# EAGLE design atmega_multimedia_control (EAGLE 6.4)
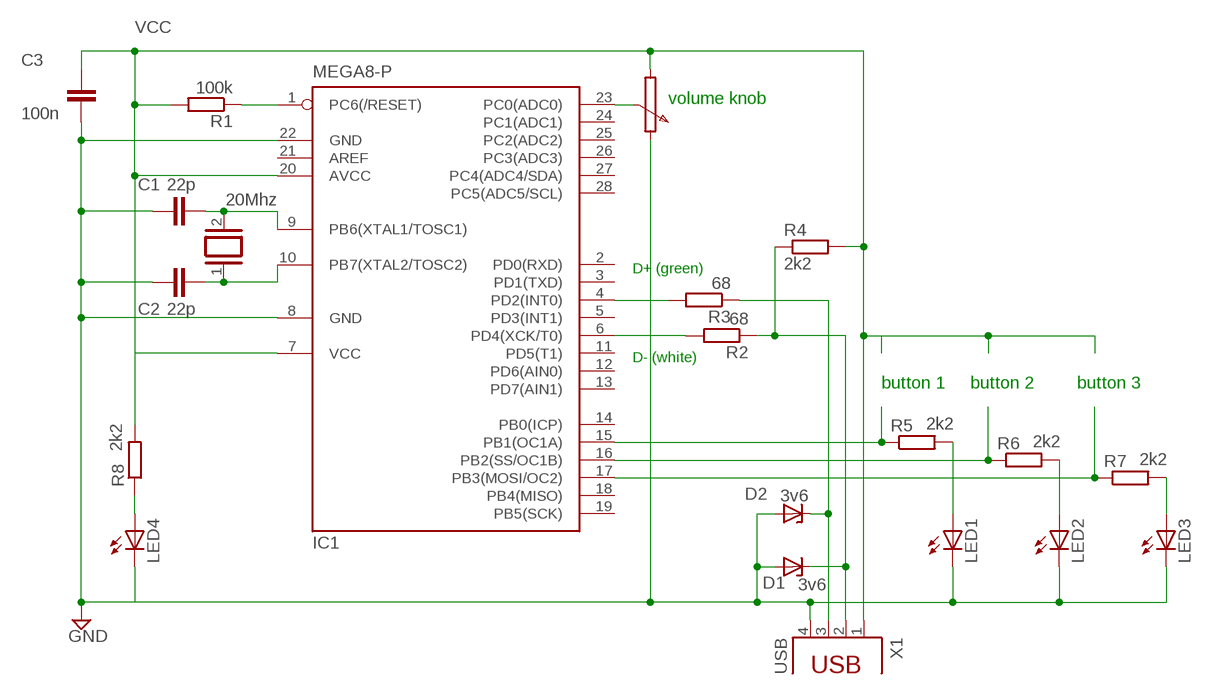
[diagram p0: schematic, sheet 1]

## Parts
C1  22p  C-EU025-025X050  [C025-025X050]
C2  22p  C-EU025-025X050  [C025-025X050]
C3  100n  C-EU025-025X050  [C025-025X050]
D1  3v6  ZENER-DIODEDO34-7  [DO34Z7]
D2  3v6  ZENER-DIODEDO34-7  [DO34Z7]
IC1  MEGA8-P  [DIL28-3]
LED1  LED3MM  [LED3MM]
LED2  LED3MM  [LED3MM]
LED3  LED3MM  [LED3MM]
LED4  LED3MM  [LED3MM]
Q1  20Mhz  XTAL/S  [QS]
R1  100k  R-EU_0204/7  [0204/7]
R2  68  R-EU_0204/7  [0204/7]
R3  68  R-EU_0204/7  [0204/7]
R4  2k2  R-EU_0204/7  [0204/7]
R5  2k2  R-EU_0204/7  [0204/7]
R6  2k2  R-EU_0204/7  [0204/7]
R7  2k2  R-EU_0204/7  [0204/7]
R8  2k2  R-EU_0204/7  [0204/7]
X1  USB  PN61729  [PN61729]

## Nets
GND: C1.1 C2.1 C3.1 D1.A D2.A IC1.8(GND) IC1.22(GND) LED1.K(C) LED2.K(C) LED3.K(C) LED4.K(C) X1.4
N$1: IC1.1(PC6(/RESET)) R1.1
N$2: C1.2 IC1.9(PB6(XTAL1/TOSC1)) Q1.2
N$3: C2.2 IC1.10(PB7(XTAL2/TOSC2)) Q1.1
N$4: D2.C R3.1 X1.3
N$5: IC1.6(PD4(XCK/T0)) R2.2
N$7: IC1.4(PD2(INT0)) R3.2
N$8: IC1.23(PC0(ADC0))
N$9: IC1.15(PB1(OC1A)) R5.1
N$10: LED1.A R5.2
N$11: IC1.16(PB2(SS/OC1B)) R6.1
N$12: LED2.A R6.2
N$13: IC1.17(PB3(MOSI/OC2)) R7.1
N$14: LED3.A R7.2
N$15: LED4.A R8.1
N$16: D1.C R2.1 R4.1 X1.2
VCC: C3.2 IC1.7(VCC) IC1.20(AVCC) R1.2 R4.2 R8.2 X1.1
Unconnected: IC1.2(PD0(RXD)) IC1.3(PD1(TXD)) IC1.5(PD3(INT1)) IC1.11(PD5(T1)) IC1.12(PD6(AIN0)) IC1.13(PD7(AIN1)) IC1.14(PB0(ICP)) IC1.18(PB4(MISO)) IC1.19(PB5(SCK)) IC1.21(AREF) IC1.24(PC1(ADC1)) IC1.25(PC2(ADC2)) IC1.26(PC3(ADC3)) IC1.27(PC4(ADC4/SDA)) IC1.28(PC5(ADC5/SCL))

## Notes on the sheet
- volume knob
- D+ (green)
- D- (white)
- button 1 | button 2 | button 3

## Library data of the parts
C1-C3 = rcl:C-EU: CAPACITOR, European symbol
D1 D2 = diode:ZENER-DIODE: Z-Diode
IC1 = atmel:MEGA8-P: MICROCONTROLLER 8 Kbytes FLASH, 1 kbytes SRAM, 512 bytes EEPROM, USART, 4-channel 10 bit ADC, 2-channel 8 bit ADC Pin compatible with Atmega48, ATMega88, ATMega168 Source: avr.lbr; OC_FARNELL: unknown; OC_NEWARK: unknown
LED1-LED4 = led:LED: LED OSRAM: - CHIPLED LG R971, LG N971, LY N971, LG Q971, LY Q971, LO R971, LY R971 LH N974, LH R974 LS Q976, LO Q976, LY Q976 LO Q996 - Hyper CHIPLED LW Q18S LB Q993, LB Q99A, LB R99A - SideLED LS A670, LO A670, LY A670, LG A670, LP A670 LB A673, LV A673, LT A673, LW A673 LH A674 LY A675 LS A676, LA A676, LO A676, LY A676, LW A676 LS A679, LY A679, LG A679 - Hyper Micro SIDELED® LS Y876, LA Y876, LO Y876, LY Y876 LT Y87S - SmartLED LW L88C, LW L88S LB L89C, LB L89S, LG L890 LS L89K, LO L89K, LY L89K LS L896, LA L896, LO L896, LY L896 - TOPLED LS T670, LO T670, LY T670, LG T670, LP T670 LSG T670, LSP T670, LSY T670, LOP T670, LYG T670 LG T671, LOG T671, LSG T671 LB T673, LV T673, LT T673, LW T673 LH T674 LS T676, LA T676, LO T676, LY T676, LB T676, LH T676, LSB T676, LW T676 LB T67C, LV T67C, LT T67C, LS T67K, LO T67K, LY T67K, LW E67C LS E67B, LA E67B, LO E67B, LY E67B, LB E67C, LV E67C, LT E67C LW T67C LS T679, LY T679, LG T679 LS T770, LO T770, LY T770, LG T770, LP T770 LB T773, LV T773, LT T773, LW T773 LH T774 LS E675, LA E675, LY E675, LS T675 LS T776, LA T776, LO T776, LY T776, LB T776 LHGB T686 LT T68C, LB T68C - Hyper Mini TOPLED® LB M676 - Mini TOPLED Santana® LG M470 LS M47K, LO M47K, LY M47K Source: http://www.osram.convergy.de LUXEON: - LUMILED® LXK2-PW12-R00, LXK2-PW12-S00, LXK2-PW14-U00, LXK2-PW14-V00 LXK2-PM12-R00, LXK2-PM12-S00, LXK2-PM14-U00 LXK2-PE12-Q00, LXK2-PE12-R00, LXK2-PE12-S00, LXK2-PE14-T00, LXK2-PE14-U00 LXK2-PB12-K00, LXK2-PB12-L00, LXK2-PB12-M00, LXK2-PB14-N00, LXK2-PB14-P00, LXK2-PB14-Q00 LXK2-PR12-L00, LXK2-PR12-M00, LXK2-PR14-Q00, LXK2-PR14-R00 LXK2-PD12-Q00, LXK2-PD12-R00, LXK2-PD12-S00 LXK2-PH12-R00, LXK2-PH12-S00 LXK2-PL12-P00, LXK2-PL12-Q00, LXK2-PL12-R00 Source: www.luxeon.com KINGBRIGHT: KA-3528ASYC Source: www.kingbright.com
Q1 = special:XTAL/S: CRYSTAL
R1-R8 = rcl:R-EU_: RESISTOR, European symbol
X1 = con-berg:PN61729: BERG USB connector; OC_FARNELL: unknown; OC_NEWARK: unknown

## Board
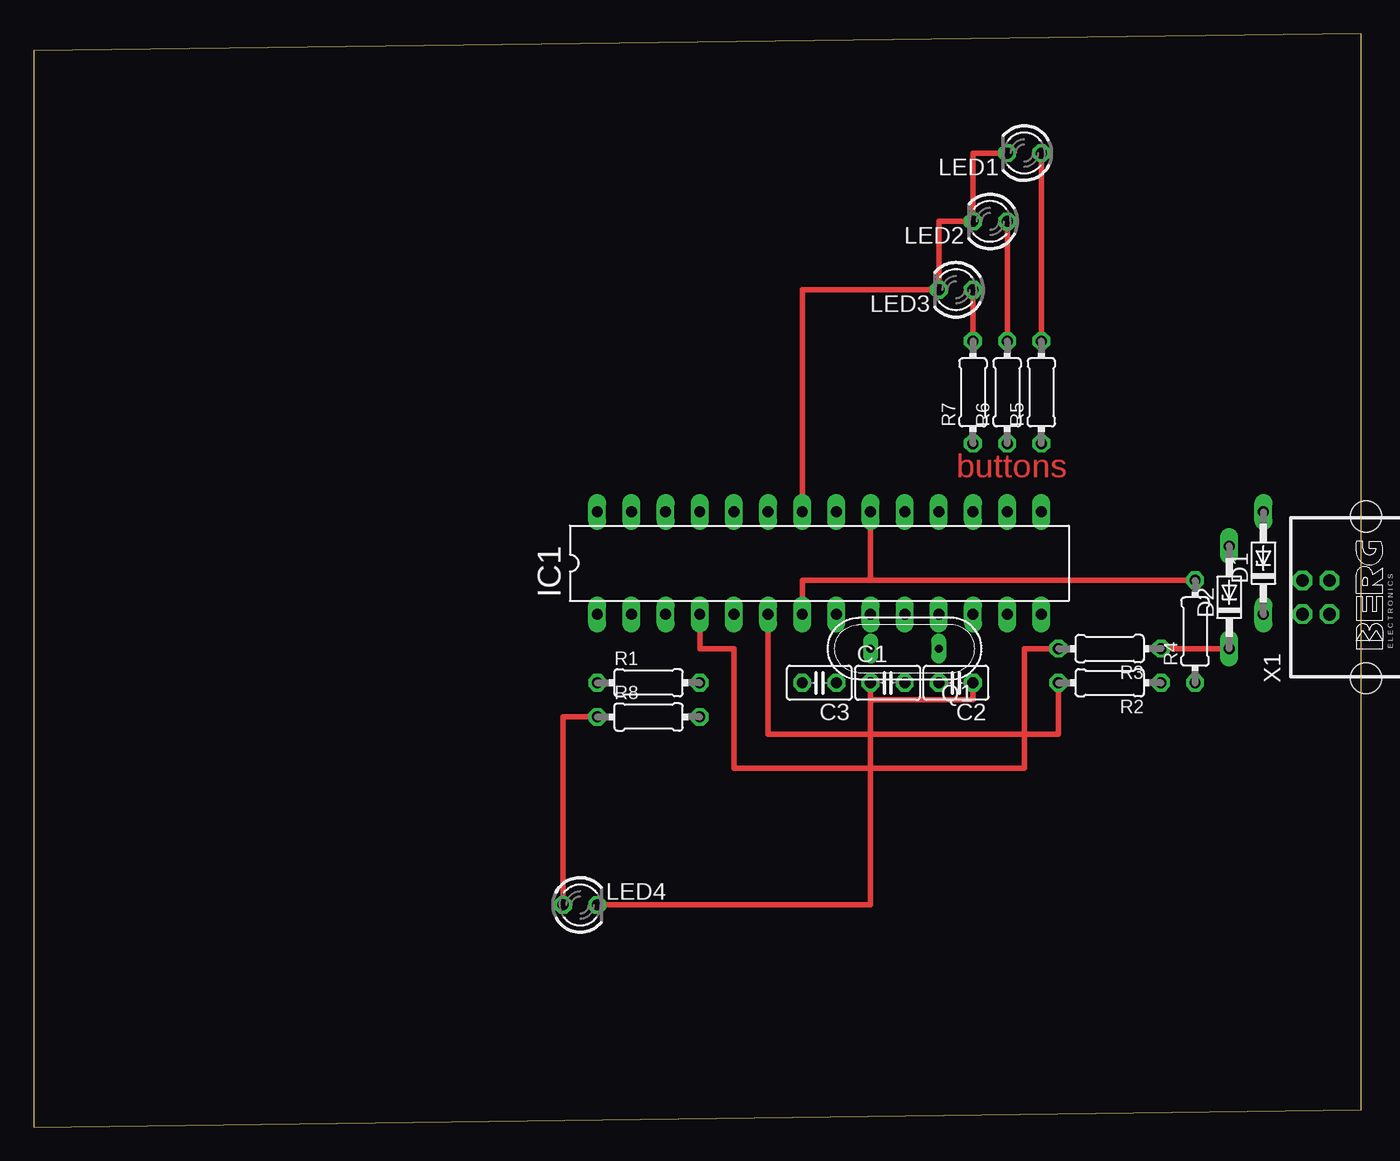
[diagram p1: board, top side]
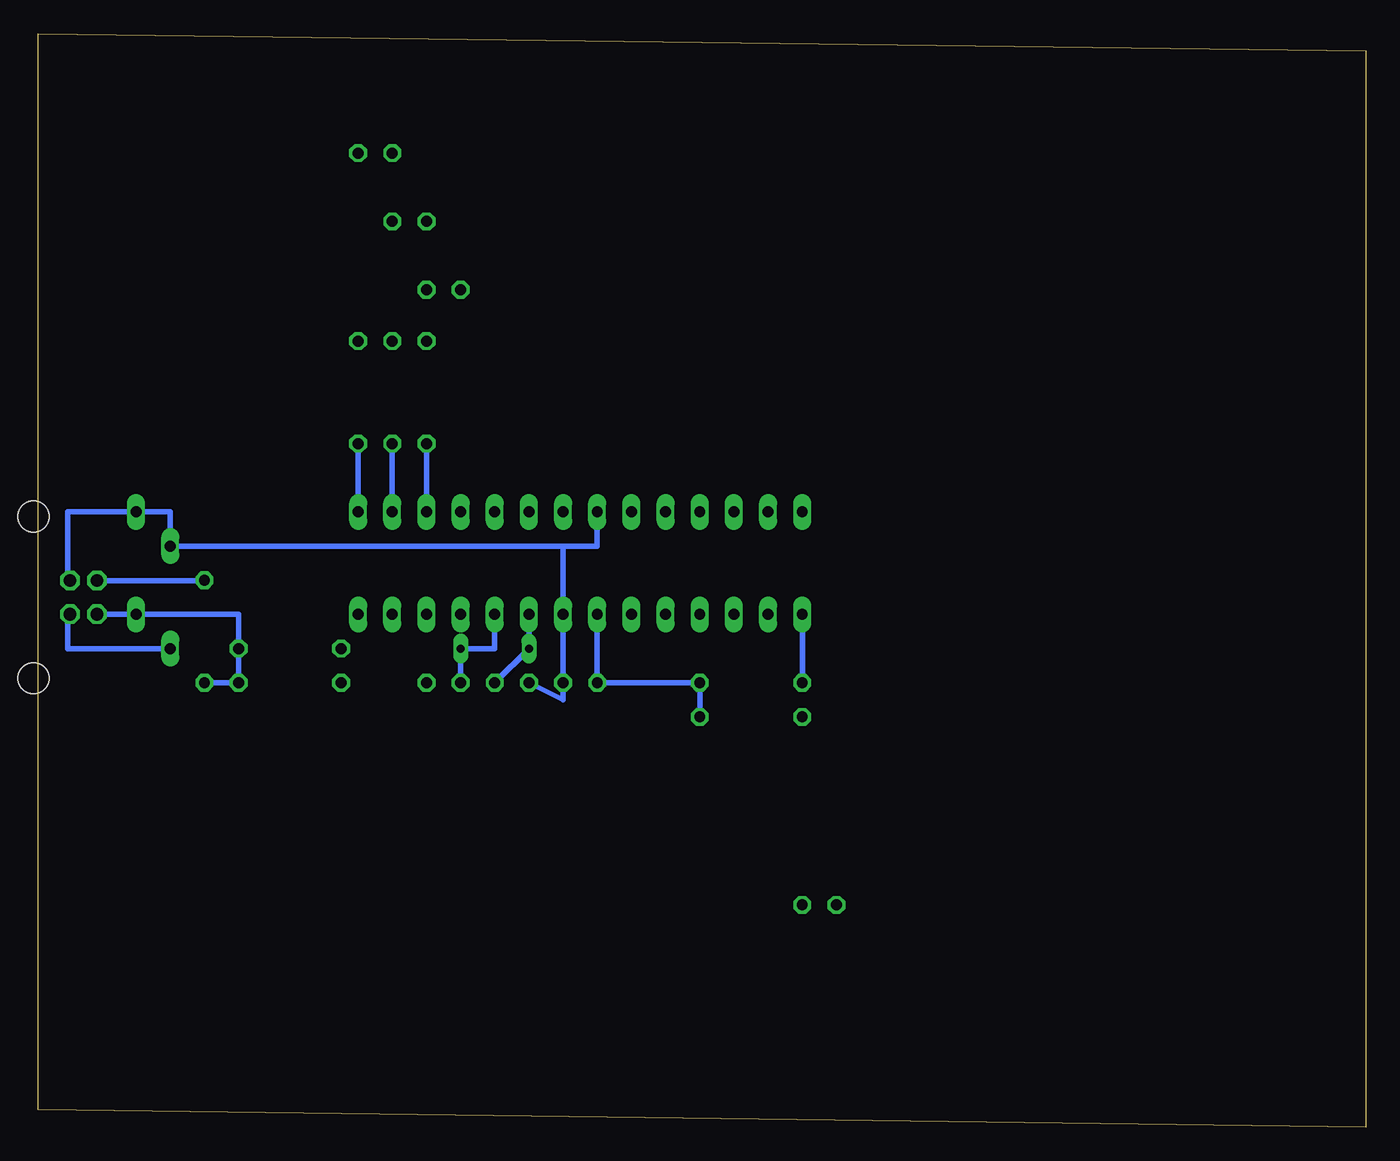
[diagram p2: board, bottom side, seen from below]

Size 98.73 x 81.27 mm. Coordinates in mm from the lower left corner, seen from the top.
Outline: 0,0 98.73,1.27 98.73,81.27 0,80 0,0
Copper layers (1*16): Top 0.035mm / dielectric 1.5mm / Bottom 0.035mm
Design rules "default": minimum track width 10mil, minimum drill 24mil, track to track 8mil, track to pad 8mil, pad to pad 8mil, via to via 8mil, smd to smd 8mil, copper to edge 40mil, drill to drill 8mil, minimum pad ring 10mil, minimum via ring 8mil, stop-mask expansion 4mil, vias tented up to drill 0mil, thermal gap 10mil

### Footprints (pad centres in the part's own frame; a part is rotated, then mirrored left to right if it is on the bottom)
C025-025X050 = drill 0.813 octagon: 1 -1.27,0; 2 1.27,0
DO34Z7 = drill 0.813 long: A 3.81,0; C -3.81,0
DIL28-3 = drill 0.813 long: 1 -16.51,-3.81; 2 -13.97,-3.81; 3 -11.43,-3.81; 4 -8.89,-3.81; 5 -6.35,-3.81; 6 -3.81,-3.81; 7 -1.27,-3.81; 8 1.27,-3.81; 9 3.81,-3.81; 10 6.35,-3.81; 11 8.89,-3.81; 12 11.43,-3.81; 13 13.97,-3.81; 14 16.51,-3.81; 15 16.51,3.81; 16 13.97,3.81; 17 11.43,3.81; 18 8.89,3.81; 19 6.35,3.81; 20 3.81,3.81; 21 1.27,3.81; 22 -1.27,3.81; 23 -3.81,3.81; 24 -6.35,3.81; 25 -8.89,3.81; 26 -11.43,3.81; 27 -13.97,3.81; 28 -16.51,3.81
LED3MM = drill 0.813 octagon: A -1.27,0; K 1.27,0
QS = drill 0.61 long: 1 -2.54,0; 2 2.54,0
0204/7 = drill 0.813 octagon: 1 -3.81,0; 2 3.81,0
PN61729 = drill 0.95 octagon: 1 1.25,4.71; 2 -1.25,4.71; 3 -1.25,2.71; 4 1.25,2.71 | hole 2.3: -6.02,0; 6.02,0

### Placement (x,y rotation side)
C1  63.5,33.02 0 top
C2  68.58,33.02 180 top
C3  58.42,33.02 180 top
D1  91.44,41.91 90 top
D2  88.9,39.37 90 top
IC1  58.42,41.91 0 top
LED1  73.66,72.39 180 top
LED2  71.12,67.31 180 top
LED3  68.58,62.23 180 top
LED4  40.64,16.51 0 top
Q1  64.77,35.56 180 top
R1  45.72,33.02 0 top
R2  80.01,33.02 180 top
R3  80.01,35.56 180 top
R4  86.36,36.83 90 top
R5  74.93,54.61 90 top
R6  72.39,54.61 90 top
R7  69.85,54.61 90 top
R8  45.72,30.48 0 top
X1  99.06,39.37 90 top

### Tracks (layer width: path | path; a pad name or v marks a point on that pad's centre or on a via)
GND
  Top 0.406: IC1.22 57.15,62.23 LED3.K 67.31,67.31 LED2.K 69.85,72.39 LED1.K | LED4.K 62.23,16.51 62.23,31.75 | C1.1 62.23,31.75 | 62.23,31.75 69.85,31.75 C2.1
  Bottom 0.406: X1.4 96.52,40.62 96.52,45.72 D1.A 88.9,45.72 D2.A 59.69,43.18 | IC1.22 57.15,43.18 59.69,43.18 | 59.69,43.18 IC1.8 C3.1 59.69,31.75 C1.1
N$1
  Bottom 0.406: R1.1 IC1.1
N$2
  Bottom 0.406: IC1.9 Q1.2 C1.2
N$3
  Bottom 0.406: C2.2 Q1.1 64.77,35.56 IC1.10
N$4
  Top 0.406: R3.1 D2.C
  Bottom 0.406: X1.3 96.52,38.12 96.52,35.56 D2.C
N$5
  Top 0.406: R2.2 76.2,29.21 54.61,29.21 IC1.6
N$7
  Top 0.406: R3.2 73.66,35.56 73.66,26.67 52.07,26.67 52.07,35.56 49.53,35.56 IC1.4
N$9
  Bottom 0.406: R5.1 IC1.15
N$10
  Top 0.406: R5.2 LED1.A
N$11
  Bottom 0.406: R6.1 IC1.16
N$12
  Top 0.406: R6.2 LED2.A
N$13
  Bottom 0.406: R7.1 IC1.17
N$14
  Top 0.406: R7.2 LED3.A
N$15
  Top 0.406: R8.1 39.37,30.48 LED4.A
N$16
  Bottom 0.406: X1.2 94.35,38.1 D1.C 83.82,38.1 R2.1 R4.1
VCC
  Top 0.406: 62.23,40.64 57.15,40.64 IC1.7 | 62.23,40.64 IC1.20 | 62.23,40.64 R4.2
  Bottom 0.406: X1.1 86.36,40.62 R4.2 | IC1.7 C3.2 R1.2 R8.2

### Text on the board
Top: buttons